# EAGLE schematic elric20-01A (EAGLE 9.5.2)
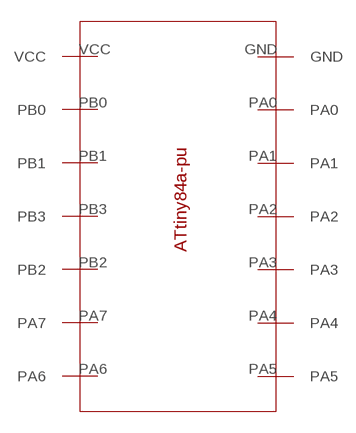
[diagram p0: schematic, sheet 1]

## Parts
U$1  ATTINY84A-PU  [ATTINY84A-PU]
Unconnected: U$1.GND U$1.PA0 U$1.PA1 U$1.PA2 U$1.PA3 U$1.PA4 U$1.PA5 U$1.PA6 U$1.PA7 U$1.PB0 U$1.PB1 U$1.PB2 U$1.PB3 U$1.VCC

## Library data of the parts
U$1 = elric:ATTINY84A-PU